# EasyEDA schematic SCH_espsomfyrts.json
TITLE: Sheet_1; REV: 1.0; Date: 2025-01-20; Sheet: 1/1; Company: Your Company
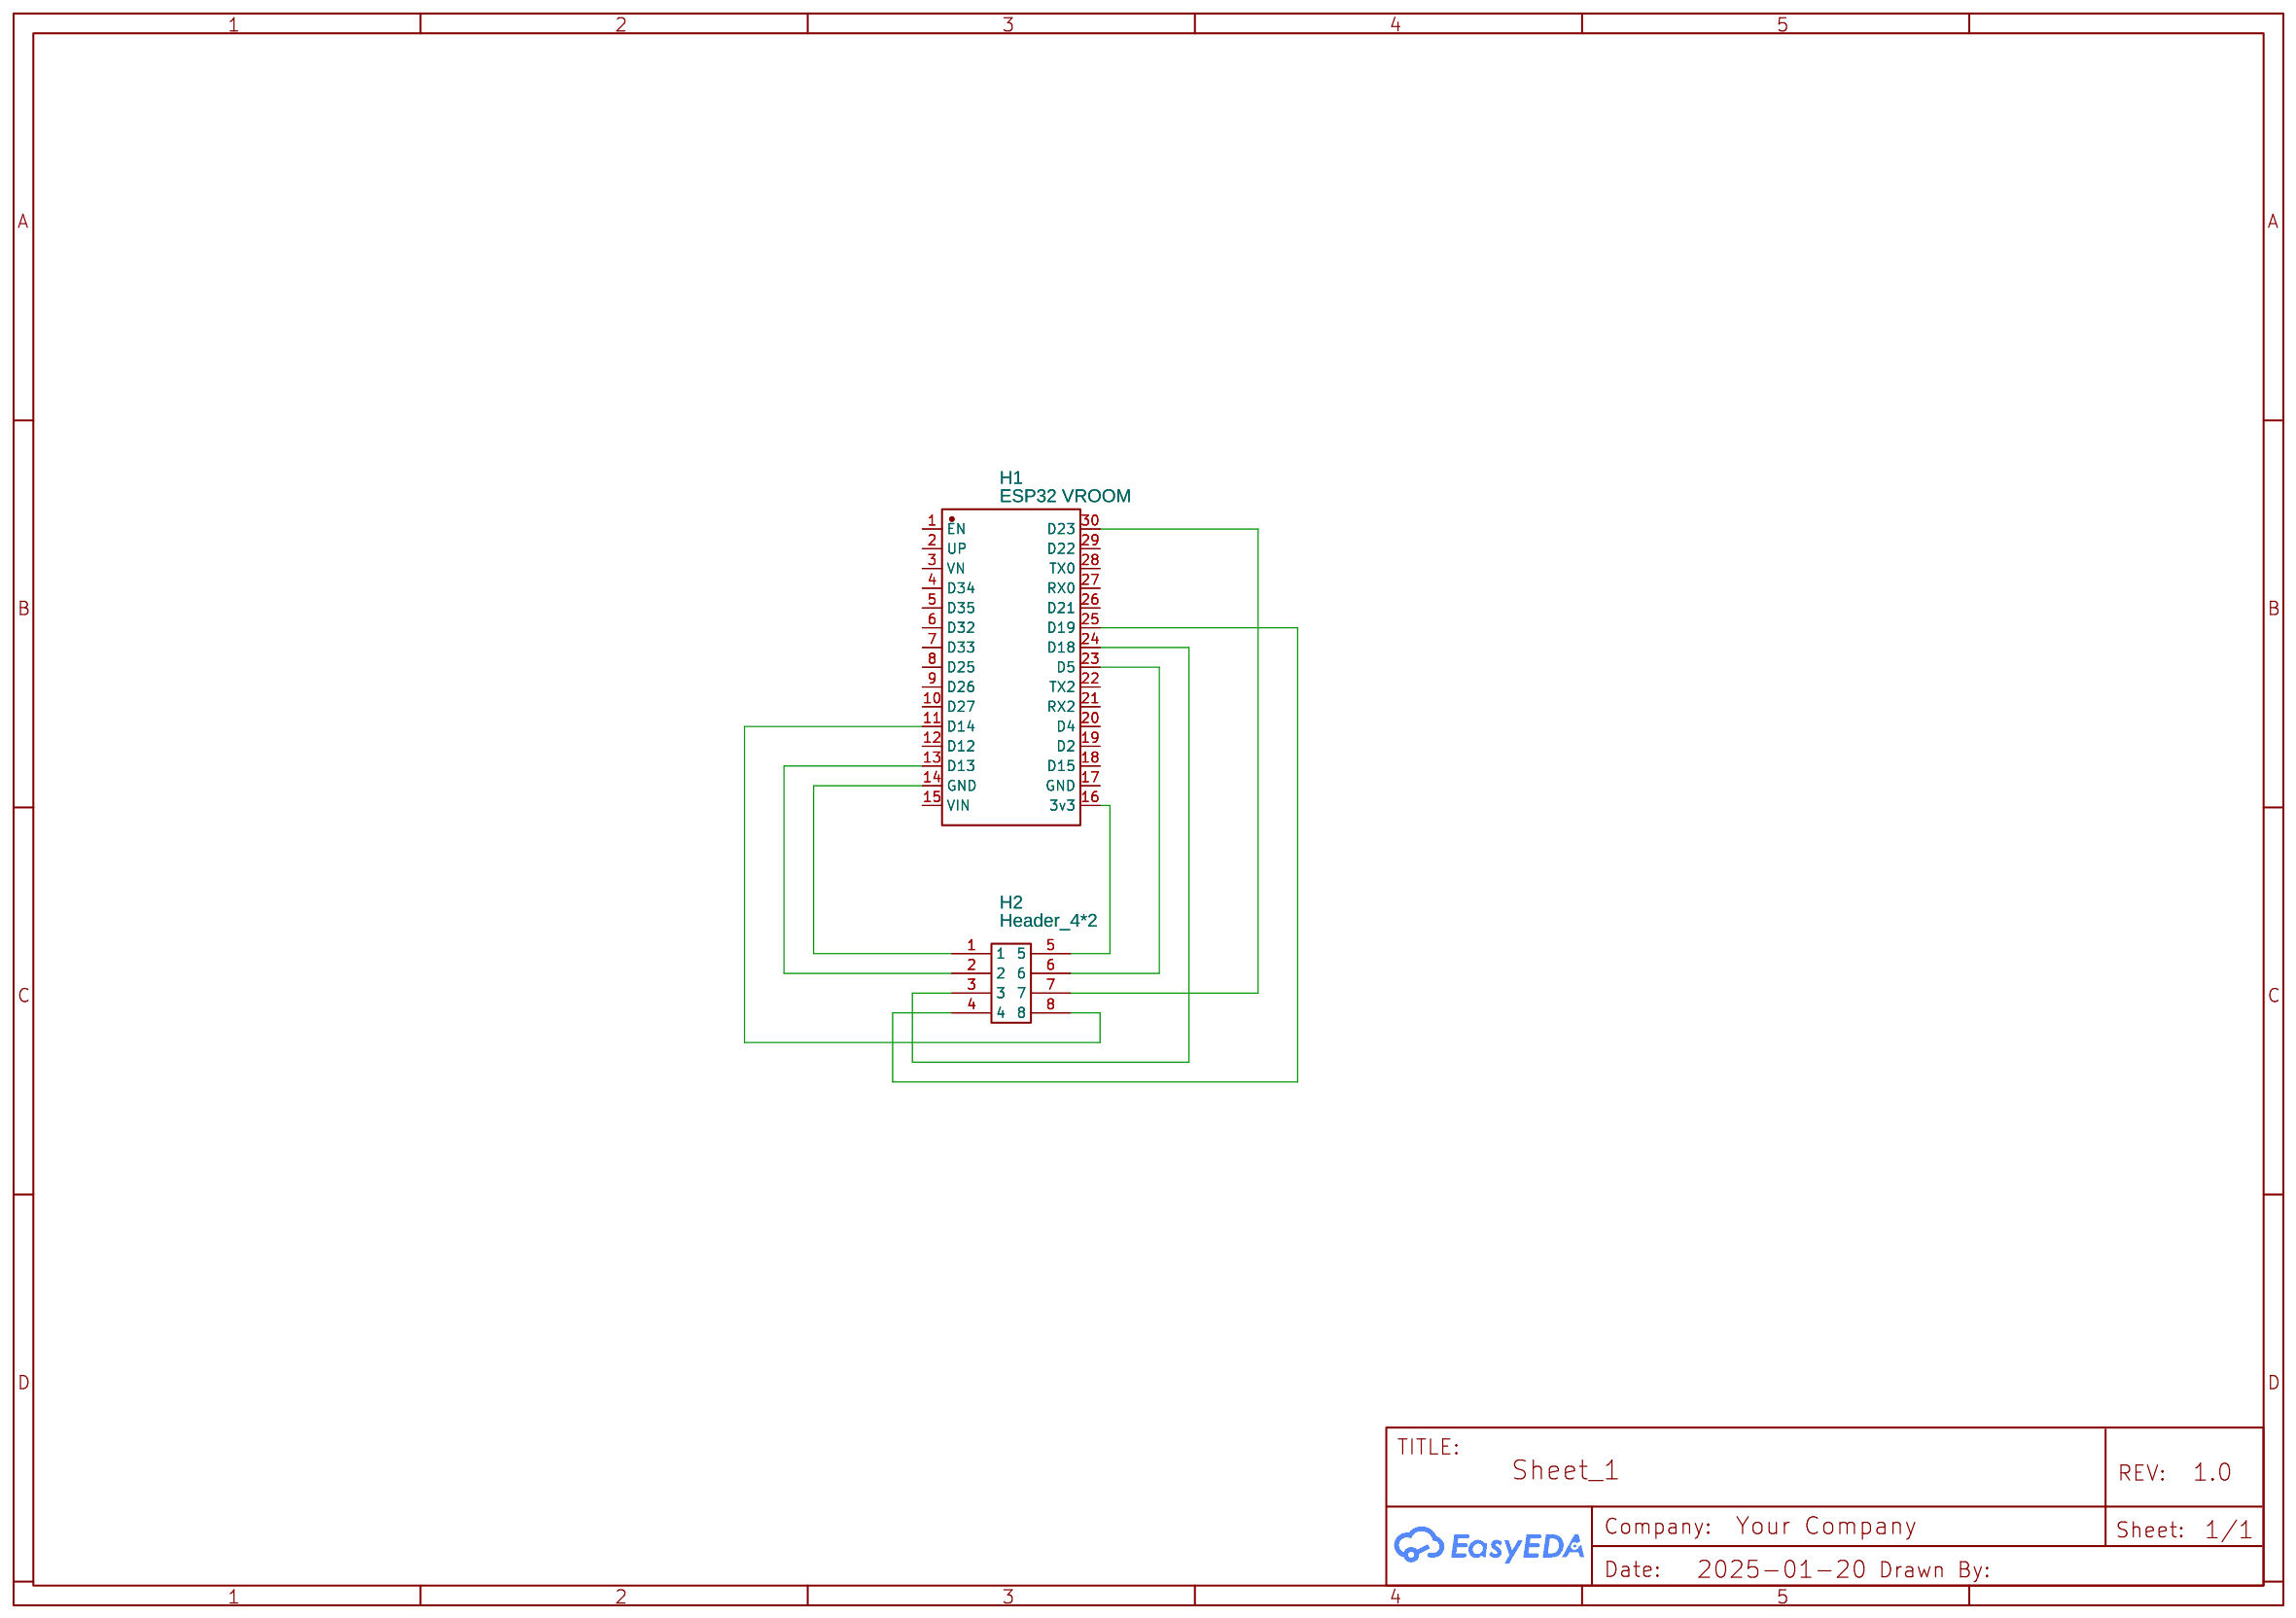
[diagram p0: schematic sheet]

## Parts
H1  ESP32 VROOM  [ESP32-VROOM]
H2  Header_4*2  [HEADER_4*2]

## Library data of the parts
H1 = ESP32 VROOM: Supplier Part: C54102; Manufacturer: ReliaPro; image: http://image.lceda.cn/szlcsc/C54102.jpg; Contributor: Электрон Жаал
H2 = Header_4*2: Contributor: harkhka

## Nets
Net-(H1-11): H1.11(D14) H2.8
Net-(H1-13): H1.13(D13) H2.2
Net-(H1-14): H1.14(GND) H2.1
Net-(H1-16): H1.16(3v3) H2.5
Net-(H1-23): H1.23(D5) H2.6
Net-(H1-24): H1.24(D18) H2.3
Net-(H1-25): H1.25(D19) H2.4
Net-(H1-30): H1.30(D23) H2.7

Not connected (* = marked no-connect by the designer): H1 1(EN) 2(UP) 3(VN) 4(D34) 5(D35) 6(D32) 7(D33) 8(D25) 9(D26) 10(D27) 12(D12) 15(VIN) 17(GND) 18(D15) 19(D2) 20(D4) 21(RX2) 22(TX2) 26(D21) 27(RX0) 28(TX0) 29(D22)
